# Altium project WDUExtensionBoard.PrjPCB
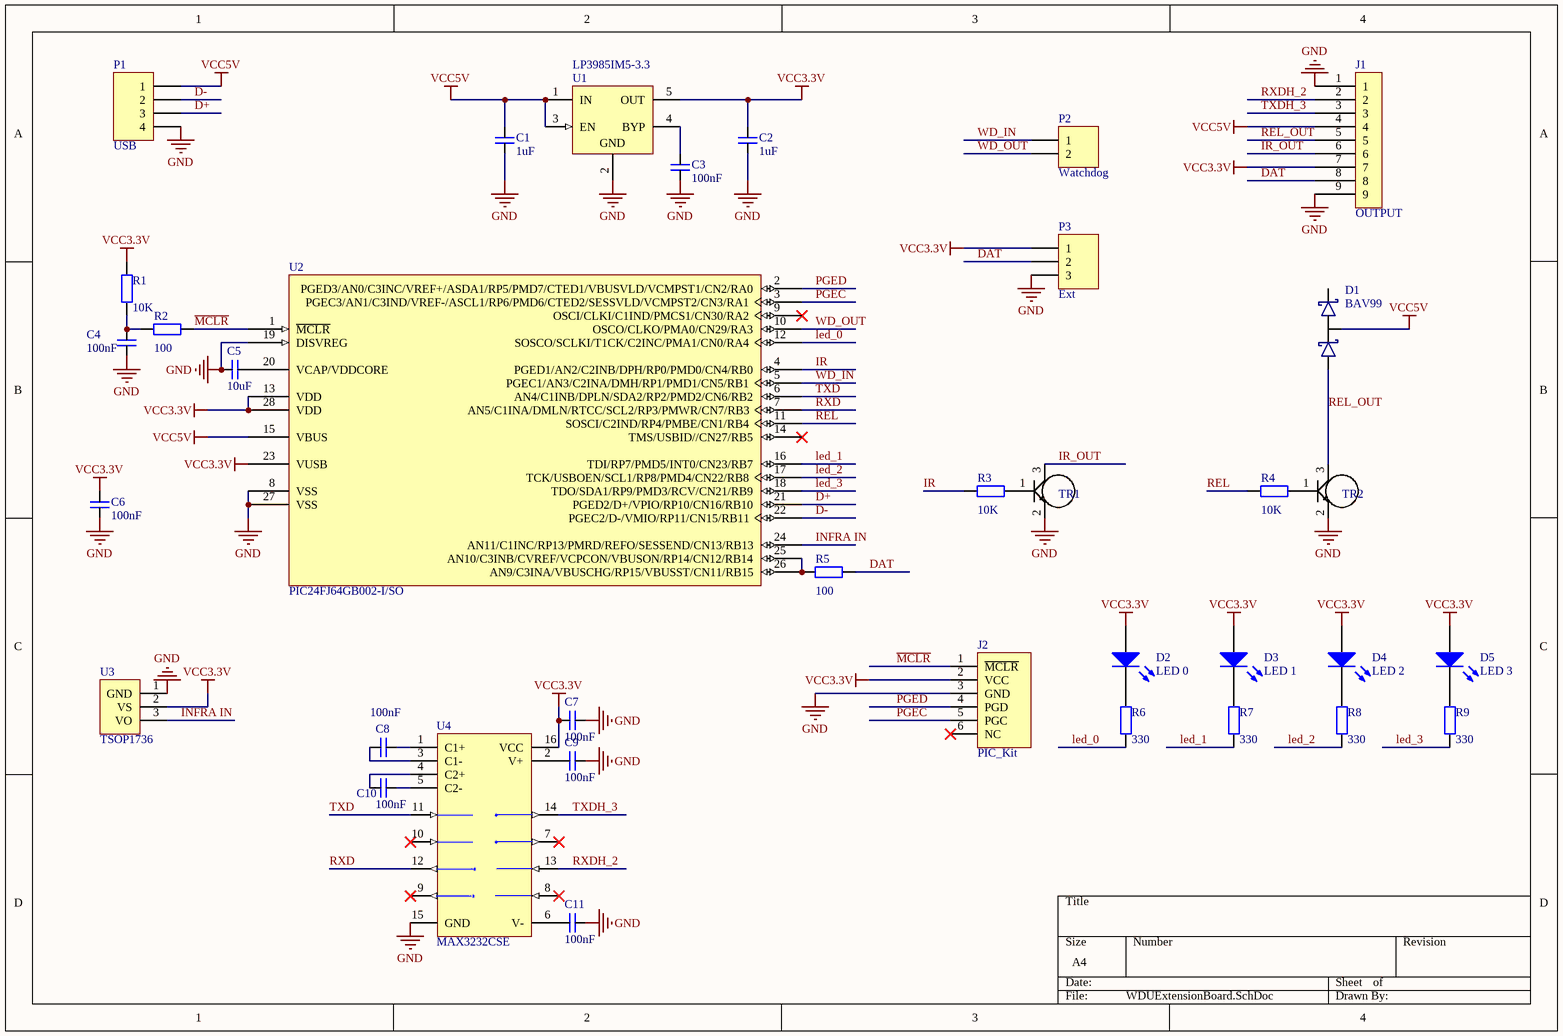
[diagram p0: WDUExtensionBoard.SchDoc]
1 sheet, 36 parts. Net scope: global (net labels, ports and power ports of the same name join across sheets).
Board file: WDUExtensionBoard.PcbDoc

## Sheet WDUExtensionBoard.SchDoc
size A4; PageSetup: Record=PageOptions|CenterHorizontal=True|CenterVertical=True|PrintScale=1.00|XCorrection=1.00|YCorrection=1.00|PrintKind=0|BorderSize=5000000|LeftOffset=0|BottomOffset=0|Orientation=2|PaperLength=1000|PaperWidth=1000|Scale=100|PaperSource=7|PrintQuality=-4|MediaType=1|DitherType=10|PaperKind=A4|PrintScaleMode=1

### Parts
C1  1uF  [0805 CAP]
C2  1uF  [0805 CAP]
C3  100nF  [0805 CAP]
C4  100nF  [0805 CAP]
C5  10uF  [0805 CAP]
C6  100nF  [0805 CAP]
C7  100nF  [0805 CAP]
C8  100nF  [0805 CAP]
C9  100nF  [0805 CAP]
C10  100nF  [0805 CAP]
C11  100nF  [0805 CAP]
D1  BAV99  [SOT23]
D2  LED 0  [1206 LED Reversed]
D3  LED 1  [1206 LED Reversed]
D4  LED 2  [1206 LED Reversed]
D5  LED 3  [1206 LED Reversed]
J1  OUTPUT  [Euroblock 3.5pitch 9P]
J2  PIC_Kit  [HDR1X6]
P1  USB  [HDR1X4]
P2  Watchdog  [HDR1X2]
P3  Ext  [HDR1X3]
R1  10K  [0805 RES]
R2  100  [0805 RES]
R3  10K  [0805 RES]
R4  10K  [0805 RES]
R5  100  [0805 RES]
R6  330  [0805 RES]
R7  330  [0805 RES]
R8  330  [0805 RES]
R9  330  [0805 RES]
TR1  BC846  [SOT23]  (value not drawn)
TR2  BC846  [SOT23]  (value not drawn)
U1  LP3985IM5-3.3  [MF05A_N]
U2  PIC24FJ64GB002-I/SO  [SSOP-28]
U3  TSOP1736  [TSOP17xx]
U4  MAX3232CSE  [NSO16_M]

### Nets
GND: C1.1(A) C2.1(A) C3.1(A) C4.1(A) C5.2(B) C6.1(A) C7.2(B) C9.2(B) C11.2(B) J1.1 J1.9 J2.3(GND) P1.4 P3.3 TR1.2 TR2.2 U1.2(GND) U2.8(VSS) U2.19(DISVREG) U2.27(VSS) U3.1(GND) U4.15(GND)
VCC3.3V: C2.2(B) C6.2(B) C7.1(A) D2.1(A) D3.1(A) D4.1(A) D5.1(A) J1.7 J2.2(VCC) P3.1 R1.2 U1.5(OUT) U2.13(VDD) U2.23(VUSB) U2.28(VDD) U3.2(VS) U4.16(VCC)
VCC5V: C1.2(B) D1.3 J1.4 P1.1 U1.1(IN) U1.3(EN) U2.15(VBUS)
D+: P1.3 U2.21(PGED2/D+/VPIO/RP10/CN16/RB10)
D-: P1.2 U2.22(PGEC2/D-/VMIO/RP11/CN15/RB11)
DAT: J1.8 P3.2 R5.1
INFRA IN: U2.24(AN11/C1INC/RP13/PMRD/REFO/SESSEND/CN13/RB13) U3.3(VO)
IR: R3.2 U2.4(PGED1/AN2/C2INB/DPH/RP0/PMD0/CN4/RB0)
IR_OUT: J1.6 TR1.3
led_0: R6.2 U2.12(SOSCO/SCLKI/T1CK/C2INC/PMA1/CN0/RA4)
led_1: R7.2 U2.16(TDI/RP7/PMD5/INT0/CN23/RB7)
led_2: R8.2 U2.17(TCK/USBOEN/SCL1/RP8/PMD4/CN22/RB8)
led_3: R9.2 U2.18(TDO/SDA1/RP9/PMD3/RCV/CN21/RB9)
~{MCLR}: J2.1(~{MCLR}) R2.1 U2.1(~{MCLR})
PGEC: J2.5(PGC) U2.3(PGEC3/AN1/C3IND/VREF-/ASCL1/RP6/PMD6/CTED2/SESSVLD/VCMPST2/CN3/RA1)
PGED: J2.4(PGD) U2.2(PGED3/AN0/C3INC/VREF+/ASDA1/RP5/PMD7/CTED1/VBUSVLD/VCMPST1/CN2/RA0)
REL: R4.2 U2.11(SOSCI/C2IND/RP4/PMBE/CN1/RB4)
REL_OUT: D1.1 J1.5 TR2.3
RXD: U2.7(AN5/C1INA/DMLN/RTCC/SCL2/RP3/PMWR/CN7/RB3) U4.12(R1OUT)
RXDH_2: J1.2 U4.13(R1IN)
TXD: U2.6(AN4/C1INB/DPLN/SDA2/RP2/PMD2/CN6/RB2) U4.11(T1IN)
TXDH_3: J1.3 U4.14(T1OUT)
WD_IN: P2.1 U2.5(PGEC1/AN3/C2INA/DMH/RP1/PMD1/CN5/RB1)
WD_OUT: P2.2 U2.10(OSCO/CLKO/PMA0/CN29/RA3)
NetC3_2: C3.2(B) U1.4(BYP)
NetC4_2: C4.2(B) R1.1 R2.2
NetC5_1: C5.1(A) U2.20(VCAP/VDDCORE)
NetC8_1: C8.1(A) U4.3(C1-)
NetC8_2: C8.2(B) U4.1(C1+)
NetC9_1: C9.1(A) U4.2(V+)
NetC10_1: C10.1(A) U4.4(C2+)
NetC10_2: C10.2(B) U4.5(C2-)
NetC11_1: C11.1(A) U4.6(V-)
NetD2_2: D2.2(K) R6.1
NetD3_2: D3.2(K) R7.1
NetD4_2: D4.2(K) R8.1
NetD5_2: D5.2(K) R9.1
NetR3_1: R3.1 TR1.1(B)
NetR4_1: R4.1 TR2.1(B)
NetR5_2: R5.2 U2.25(AN10/C3INB/CVREF/VCPCON/VBUSON/RP14/CN12/RB14) U2.26(AN9/C3INA/VBUSCHG/RP15/VBUSST/CN11/RB15)

Not connected (* = marked no-connect by the designer): D1 2; J2 6(NC)*; U2 9(OSCI/CLKI/C1IND/PMCS1/CN30/RA2)* 14(TMS/USBID//CN27/RB5)*; U4 7(T2OUT)* 8(R2IN)* 9(R2OUT)* 10(T2IN)*

### Library data of the parts
C1-C11 = CAP: Capacitor
  C1 C2: VALUE: 1uF
  C3 C4 C6-C11: VALUE: 100nF
  C5: VALUE: 10uF
D1 = BAV99: Dual Schottky series - 0.2A, 75V
D2-D5 = LED2: Typical RED, GREEN, YELLOW, AMBER GaAs LED; Published: 8-Jun-2000; LatestRevisionDate: 17-Jul-2002; LatestRevisionNote: Re-released for DXP Platform.; PackageVersion: Feb-2002; PackageReference: 3.2X1.6X1.1; Publisher: Altium Limited
J1 = Euroblock 9P connector
J2 = PIC_Kit: PIC Kit connector
P1 = Header 4: Header, 4-Pin; LatestRevisionDate: 17-Jul-2002; LatestRevisionNote: Re-released for DXP Platform.; Publisher: Altium Limited
P2 = Header 2: Header, 2-Pin; LatestRevisionDate: 17-Jul-2002; LatestRevisionNote: Re-released for DXP Platform.; Publisher: Altium Limited
P3 = Header 3: Header, 3-Pin; LatestRevisionDate: 17-Jul-2002; LatestRevisionNote: Re-released for DXP Platform.; Publisher: Altium Limited
R1-R9 = RES: Resistor; Published: 8-Jun-2000; LatestRevisionDate: 17-Jul-2002; LatestRevisionNote: Re-released for DXP Platform.; PackageReference: AXIAL-0.4; Publisher: Altium Limited
  R1 R3 R4: Value: 10K
  R2 R5: Value: 100
  R6-R9: Value: 330
TR1 TR2 = BC846: NPN Transistor, 80 V, SOT23
U1 = LP3985IM5-3.3: Micropower, 150mA Low-Noise Ultra Low-Dropout CMOS Voltage Regulator; Manufacturer: National Semiconductor; CompType: LDO IC; PackageTopMarking: LDQB*XTT; PowerWise: N; Published: 4-Dec-2008; DatasheetVersion: Aug-2005; PackageVersion: revD, Aug-2008; PackageReference: MF05A; Publisher: Altium Limited; PackageDescription: Molded SOT-23, .115 x .063 x .040 in Body, 5 Lead, .0375 in Pitch; PartNumber: LP3985IM5-3.3; RoHS: O; PinCount: 5; DigiKeyPartNumber: LP3985IM5-3.3CT-ND; ComponentLink1Description: LP3985 Datasheet; ComponentLink1URL: http://www.national.com/ds/LP/LP3985.pdf; ComponentLink2Description: LP3985 Web Page; ComponentLink2URL: http://www.national.com/pf/LP/LP3985.html; ComponentLink3Description: MF05A Package Page; ComponentLink3URL: http://www.national.com/packaging/folders/mf05a.html
U2 = PIC24FJ64GB002-I/SO: 16-Bit Flash Microcontroller with USB On-The-Go and nanoWatt XLP, 64KB Flash, 8KB SRAM, 28-Pin SOIC, Industrial Temperature; FirstPublished: 2-Dec-2009; DatasheetVersion: revC, Oct-2009; PackageVersion: revBB, Aug-2009; PackageReference: QFN-ML28; Publisher: Altium Limited; PackageDescription: 28-Lead Plastic Quad Flat, No Lead Package (ML) - 6x6 mm Body [QFN] with 0.55 mm Contact Length; Supplier 1: Digi-Key; Supplier Part Number 1: PIC24FJ64GB002-I/ML-ND; Supplier 2: Farnell; Supplier Part Number 2: 1777472; Supplier 3: Newark; Supplier Part Number 3: 07P9737; Code_JEDEC: MO-220; Code_IPC: QFN65P600X600-28V; ComponentLink1Description: Datasheet; ComponentLink1URL: http://ww1.microchip.com/downloads/en/DeviceDoc/39951b.pdf; ComponentLink2Description: Packaging Specification; ComponentLink2URL: http://www.microchip.com/stellent/groups/techpub_sg/documents/packagingspec/en012702.pdf; ComponentLink3Description: Microchip.com Home; ComponentLink3URL: http://www.microchip.com/
U3 = TSOP17xx: IR Receiver, 3-Pin; LatestRevisionDate: 17-Jul-2002; LatestRevisionNote: Re-released for DXP Platform.; Publisher: Altium Limited
U4 = MAX3232CSE: 3.0V TO 5.5V, Low-Power, up to 1Mbps, True RS-232 Transceiver Using Four 0.1µF External Capacitor; Published: 16-Jan-2001; LatestRevisionDate: 13-Apr-2006; LatestRevisionNote: IPC-7351 Footprint Added.; DatasheetVersion: Mar-1999; PackageReference: NSO16; Publisher: Altium Limited; PackageDescription: 16-Pin Small Outline Integrated Circuit 1.27 mm Pitch; Code_JEDEC: MS-012-AC; Code_IPC: SOIC127P600-16; ComponentLink1Description: Manufacturer Link; ComponentLink1URL: http://www.maxim-ic.com/; ComponentLink2Description: Datasheet; ComponentLink2URL: http://pdfserv.maxim-ic.com/en/ds/MAX3222-MAX3241.pdf